# Altium schematic sheet TI1-1-Top.SchDoc: Top
size A3; SheetNumber: 1; SheetTotal: 1
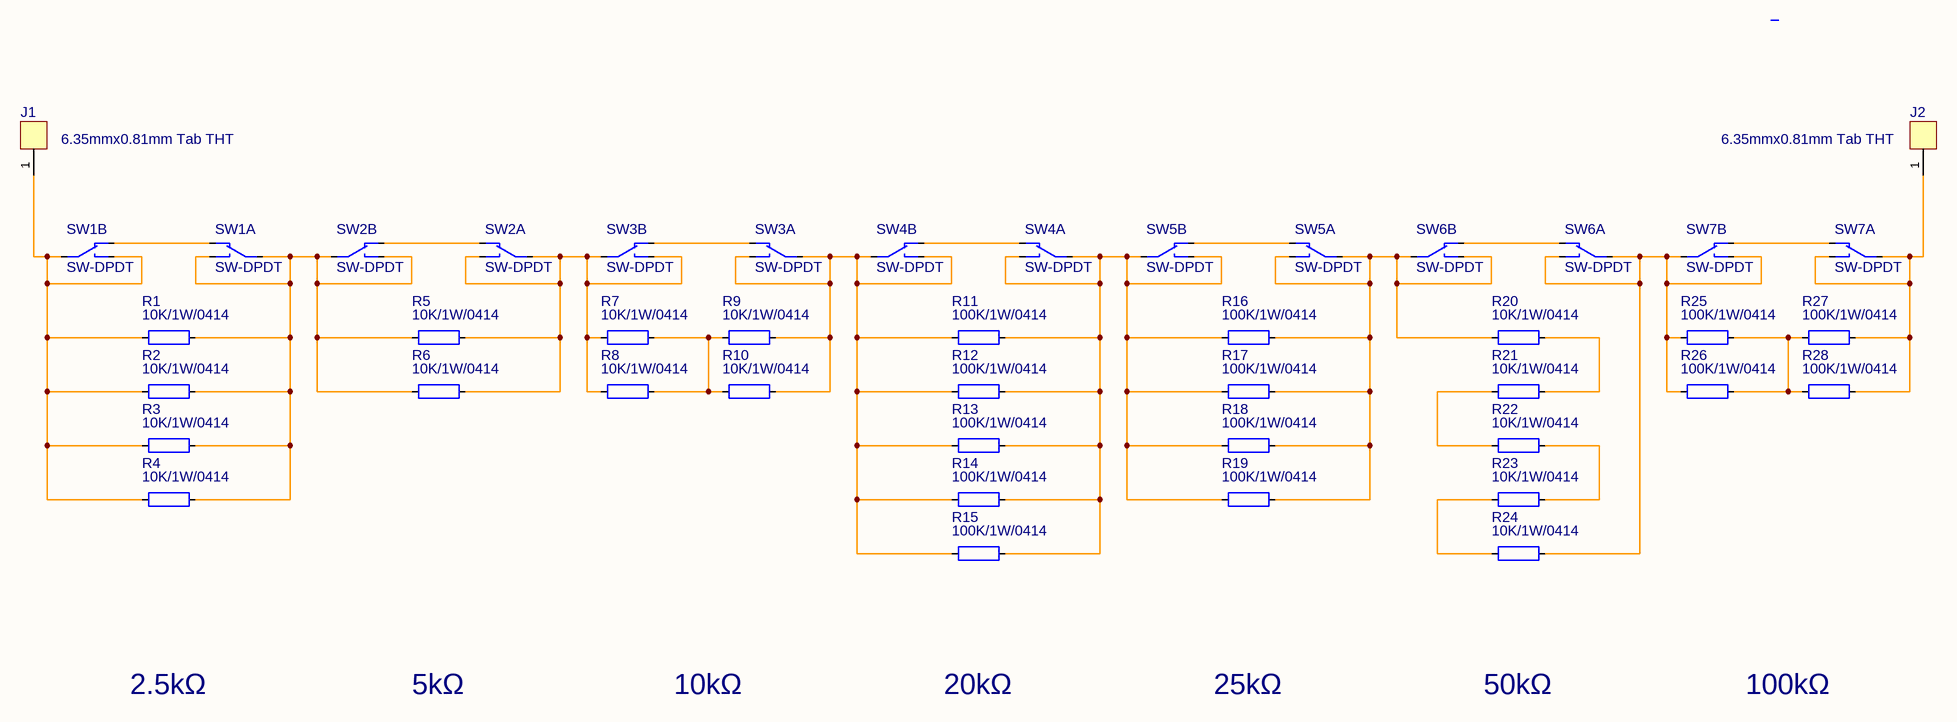
[diagram p0: TI1-1-Top.SchDoc]

## Parts
J1  6.35mmx0.81mm Tab THT  [Tab_THT_635]
J2  6.35mmx0.81mm Tab THT  [Tab_THT_635]
R1  10K/1W/0414  [RESAD1500W80L1200D400B]
R2  10K/1W/0414  [RESAD1500W80L1200D400B]
R3  10K/1W/0414  [RESAD1500W80L1200D400B]
R4  10K/1W/0414  [RESAD1500W80L1200D400B]
R5  10K/1W/0414  [RESAD1500W80L1200D400B]
R6  10K/1W/0414  [RESAD1500W80L1200D400B]
R7  10K/1W/0414  [RESAD1500W80L1200D400B]
R8  10K/1W/0414  [RESAD1500W80L1200D400B]
R9  10K/1W/0414  [RESAD1500W80L1200D400B]
R10  10K/1W/0414  [RESAD1500W80L1200D400B]
R11  100K/1W/0414  [RESAD1500W80L1200D400B]
R12  100K/1W/0414  [RESAD1500W80L1200D400B]
R13  100K/1W/0414  [RESAD1500W80L1200D400B]
R14  100K/1W/0414  [RESAD1500W80L1200D400B]
R15  100K/1W/0414  [RESAD1500W80L1200D400B]
R16  100K/1W/0414  [RESAD1500W80L1200D400B]
R17  100K/1W/0414  [RESAD1500W80L1200D400B]
R18  100K/1W/0414  [RESAD1500W80L1200D400B]
R19  100K/1W/0414  [RESAD1500W80L1200D400B]
R20  10K/1W/0414  [RESAD1500W80L1200D400B]
R21  10K/1W/0414  [RESAD1500W80L1200D400B]
R22  10K/1W/0414  [RESAD1500W80L1200D400B]
R23  10K/1W/0414  [RESAD1500W80L1200D400B]
R24  10K/1W/0414  [RESAD1500W80L1200D400B]
R25  100K/1W/0414  [RESAD1500W80L1200D400B]
R26  100K/1W/0414  [RESAD1500W80L1200D400B]
R27  100K/1W/0414  [RESAD1500W80L1200D400B]
R28  100K/1W/0414  [RESAD1500W80L1200D400B]
SW1  SW-DPDT  [RND_DPDT_12.6mm_210-00450]  (parts A,B of 2)
SW2  SW-DPDT  [RND_DPDT_12.6mm_210-00450]  (parts A,B of 2)
SW3  SW-DPDT  [RND_DPDT_12.6mm_210-00450]  (parts A,B of 2)
SW4  SW-DPDT  [RND_DPDT_12.6mm_210-00450]  (parts A,B of 2)
SW5  SW-DPDT  [RND_DPDT_12.6mm_210-00450]  (parts A,B of 2)
SW6  SW-DPDT  [RND_DPDT_12.6mm_210-00450]  (parts A,B of 2)
SW7  SW-DPDT  [RND_DPDT_12.6mm_210-00450]  (parts A,B of 2)

## Nets
NetJ1_1: J1.1 R1.2 R2.2 R3.2 R4.2 SW1.4(COM2) SW1.6(NO2)
NetJ2_1: J2.1 R27.1 R28.1 SW7.1(COM1) SW7.3(NO1)
NetR1_1: R1.1 R2.1 R3.1 R4.1 R5.2 R6.2 SW1.1(COM1) SW1.3(NO1) SW2.4(COM2) SW2.6(NO2)
NetR5_1: R5.1 R6.1 R7.2 R8.2 SW2.1(COM1) SW2.3(NO1) SW3.4(COM2) SW3.6(NO2)
NetR7_1: R7.1 R8.1 R9.2 R10.2
NetR9_1: R9.1 R10.1 R11.2 R12.2 R13.2 R14.2 R15.2 SW3.1(COM1) SW3.3(NO1) SW4.4(COM2) SW4.6(NO2)
NetR11_1: R11.1 R12.1 R13.1 R14.1 R15.1 R16.2 R17.2 R18.2 R19.2 SW4.1(COM1) SW4.3(NO1) SW5.4(COM2) SW5.6(NO2)
NetR16_1: R16.1 R17.1 R18.1 R19.1 R20.2 SW5.1(COM1) SW5.3(NO1) SW6.4(COM2) SW6.6(NO2)
NetR20_1: R20.1 R21.1
NetR21_2: R21.2 R22.2
NetR22_1: R22.1 R23.1
NetR23_2: R23.2 R24.2
NetR24_1: R24.1 R25.2 R26.2 SW6.1(COM1) SW6.3(NO1) SW7.4(COM2) SW7.6(NO2)
NetR25_1: R25.1 R26.1 R27.2 R28.2
NetSW1_2: SW1.2(NC1) SW1.5(NC2)
NetSW2_2: SW2.2(NC1) SW2.5(NC2)
NetSW3_2: SW3.2(NC1) SW3.5(NC2)
NetSW4_2: SW4.2(NC1) SW4.5(NC2)
NetSW5_2: SW5.2(NC1) SW5.5(NC2)
NetSW6_2: SW6.2(NC1) SW6.5(NC2)
NetSW7_2: SW7.2(NC1) SW7.5(NC2)

## Notes on the sheet
- 2.5kΩ
- 5kΩ
- 10kΩ
- 20kΩ
- 25kΩ
- 50kΩ
- 100kΩ
- Date:
- Size:
- A3
- Schema:
- Layout:

## Library data of the parts
J1 J2 = Tab_025_THT: CONN QC TAB 0.250 SOLDER; Manufacturer: GENERIC; Manufacturer 1: TE Connectivity AMP Connectors; Manufacturer Part Number 1: 1217861-1; Part Number: Tab_025_THT; HelpURL: https://www.te.com/usa-en/product-1217861-1.datasheet.pdf; Supplier 1: Digi-Key; Supplier Part Number 1: A100452CT-ND; Manufacturer 3: TE Connectivity; Manufacturer Part Number 3: 1217861-1; Supplier 3: LCSC; Supplier Part Number 3: C428480
R1-R10 R20-R24 = 10K/1W/0414: RES TH 1W 0414 10K; Manufacturer: GENERIC; Manufacturer 1: Vishay; Manufacturer Part Number 1: MBE04140C1002FC100; Absolute Value: 10000; Part Number: 10K/1W/0414; Package: 0414; Value: 10K; HelpURL: https://www.vishay.com/docs/28766/mbxsma.pdf; Supplier 1: Distrelec; Supplier Part Number 1: 160-59-946
R11-R19 R25-R28 = 100K/1W/0414: RES TH 1W 0414 100K; Manufacturer: GENERIC; Manufacturer 1: Vishay; Manufacturer Part Number 1: MBE04140C1003FC100; Absolute Value: 100000; Part Number: 100K/1W/0414; Package: 0414; Value: 100K; HelpURL: https://www.vishay.com/docs/28766/mbxsma.pdf; Supplier 1: Distrelec; Supplier Part Number 1: 160-59-946
SW1-SW7 = SW-DPDT-RND-210-00450: Miniature Toggle Switch, ON-ON, DPDT, 2A, IP67; Manufacturer: RND; Manufacturer Part Number 1: RND 210-00450; Part Number: SW-DPDT-RND-210-00450; HelpURL: https://media.distrelec.com/Web/Downloads/_t/ds/RND_210-00450_eng_tds.pdf; Manufacturer 1: RND; Supplier 1: Distrelec; Supplier Part Number 1: 301-03-435